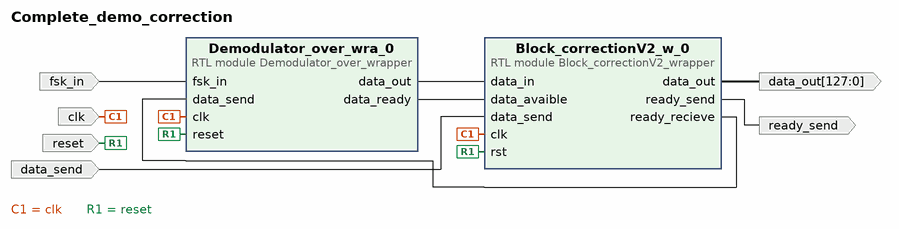
[diagram p0: block diagram of the top level]
# Vivado block design Complete_demo_correction, xc7z020clg400-1, Vivado 2023.1
create_bd_design Complete_demo_correction

create_bd_port -dir I clk
create_bd_port -dir I reset
create_bd_port -dir I fsk_in
create_bd_port -dir O -from 127 -to 0 data_out
create_bd_port -dir O ready_send
create_bd_port -dir I data_send

create_bd_cell -type module -reference Demodulator_over_wrapper Demodulator_over_wra_0
create_bd_cell -type module -reference Block_correctionV2_wrapper Block_correctionV2_w_0

# ---- connections ----

connect_bd_net [get_bd_pins Block_correctionV2_w_0/data_out] [get_bd_ports data_out]
connect_bd_net [get_bd_pins Block_correctionV2_w_0/ready_recieve] [get_bd_pins Demodulator_over_wra_0/data_send]
connect_bd_net [get_bd_pins Block_correctionV2_w_0/ready_send] [get_bd_ports ready_send]
connect_bd_net [get_bd_pins Demodulator_over_wra_0/data_out] [get_bd_pins Block_correctionV2_w_0/data_in]
connect_bd_net [get_bd_pins Demodulator_over_wra_0/data_ready] [get_bd_pins Block_correctionV2_w_0/data_avaible]
connect_bd_net [get_bd_ports clk] [get_bd_pins Demodulator_over_wra_0/clk] [get_bd_pins Block_correctionV2_w_0/clk]
connect_bd_net [get_bd_ports data_send] [get_bd_pins Block_correctionV2_w_0/data_send]
connect_bd_net [get_bd_ports fsk_in] [get_bd_pins Demodulator_over_wra_0/fsk_in]
connect_bd_net [get_bd_ports reset] [get_bd_pins Demodulator_over_wra_0/reset] [get_bd_pins Block_correctionV2_w_0/rst]

validate_bd_design
save_bd_design
